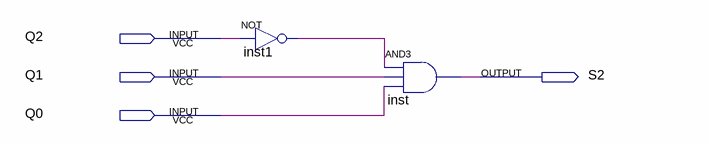
[diagram p0: schematic sheet]
// Quartus schematic S2_C0.bdf as structural Verilog: 2 symbols, 4 pins
module S2_C0 (
  input  Q2,
  input  Q1,
  input  Q0,
  output S2
);

  wire inst1_out;

  not inst1 (inst1_out, Q2);
  and inst (S2, inst1_out, Q1, Q0);
endmodule
